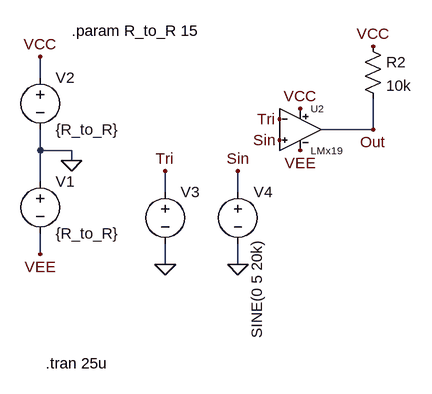
[diagram p0: schematic Test (If Spice works) LM319.asc]
Test (If Spice works) LM319.asc, the LTspice schematic file:
Version 4.1
SHEET 1 880 872
WIRE -176 64 -176 32
WIRE 336 144 336 96
WIRE 336 144 256 144
WIRE -176 176 -176 144
WIRE -128 176 -176 176
WIRE -128 192 -128 176
WIRE -176 224 -176 176
WIRE 16 240 16 208
WIRE 128 240 128 208
WIRE -176 336 -176 304
WIRE 16 352 16 320
WIRE 128 352 128 320
FLAG -176 32 VCC
FLAG 16 208 Tri
FLAG 128 208 Sin
FLAG 128 352 0
FLAG 16 352 0
FLAG 224 112 VCC
FLAG 192 128 Tri
FLAG 192 160 Sin
FLAG 336 16 VCC
FLAG -128 192 0
FLAG -176 336 VEE
FLAG 224 176 VEE
FLAG 336 144 Out
SYMBOL voltage -176 48 R0
WINDOW 123 0 0 Left 0
WINDOW 39 0 0 Left 0
SYMATTR InstName V2
SYMATTR Value {R_to_R}
SYMBOL voltage 16 224 R0
WINDOW 3 24 96 Invisible 2
WINDOW 123 0 0 Left 0
WINDOW 39 0 0 Left 0
SYMATTR Value PWL file=triangle_300kHz_5Vp_-5Vn_1ms.pwl
SYMATTR InstName V3
SYMBOL voltage 128 224 R0
WINDOW 3 29 91 VRight 2
WINDOW 123 0 0 Left 0
WINDOW 39 0 0 Left 0
SYMATTR Value SINE(0 5 20k)
SYMATTR InstName V4
SYMBOL res 320 0 R0
SYMATTR InstName R2
SYMATTR Value 10k
SYMBOL voltage -176 208 R0
WINDOW 123 0 0 Left 0
WINDOW 39 0 0 Left 0
SYMATTR InstName V1
SYMATTR Value {R_to_R}
SYMBOL ZmySymbol\\Comperators\\LM319 224 80 R0
SYMATTR InstName U2
TEXT -128 -8 Left 2 !.param R_to_R 15
TEXT -168 504 Left 2 !.tran 25u

The netlist it stands for:
* Test (If Spice works) LM319.asc
V2 VCC 0 {R_to_R}
V3 Tri 0 PWL file=triangle_300kHz_5Vp_-5Vn_1ms.pwl
V4 Sin 0 SINE(0 5 20k)
R2 VCC Out 10k
V1 0 VEE {R_to_R}
X§U2 Sin Tri VCC VEE Out LMx19  ; pins In+ In- V+ V- OUT
.param R_to_R 15
.tran 25u
.lib LMx19.lib
.backanno
.end